# EAGLE design RdL_main_v03 (EAGLE 7.6.0)
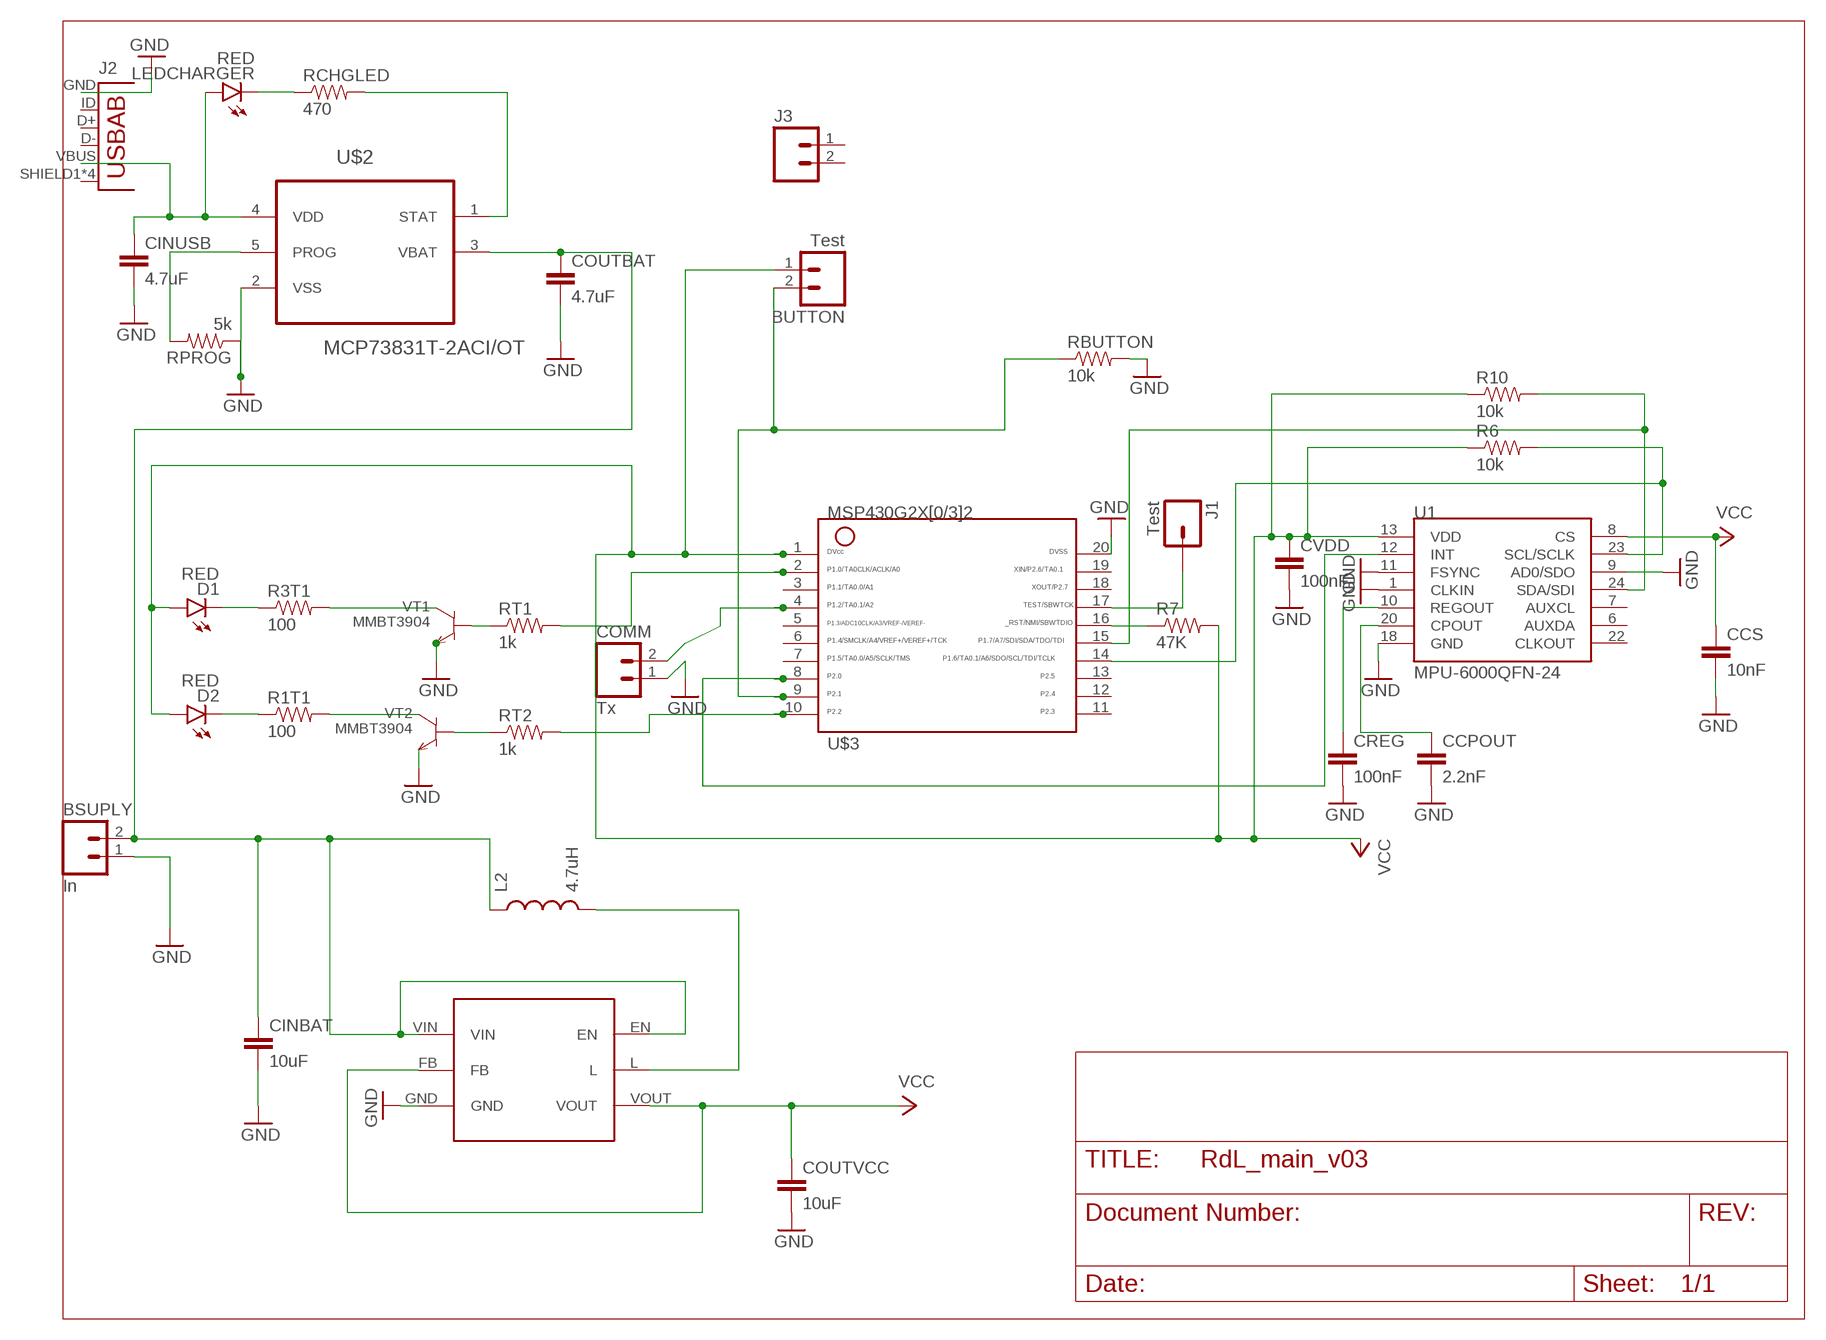
[diagram p0: schematic, sheet 1]

## Parts
BSUPLY  In  M02PTH  [1X02]
BUTTON  Test  M02PTH  [1X02]
CCPOUT  2.2nF  CAP0805  [0805]
CCS  10nF  CAP0805  [0805]
CINBAT  10uF  CAP0805  [0805]
CINUSB  4.7uF  CAP0805  [0805]
COMM  Tx  M02PTH  [1X02]
COUTBAT  4.7uF  CAP0805  [0805]
COUTVCC  10uF  CAP0805  [0805]
CREG  100nF  CAP0805  [0805]
CVDD  100nF  CAP0805  [0805]
D1  RED  LED-RED1206  [LED-1206]
D2  RED  LED-RED1206  [LED-1206]
J1  Test  M01PTH  [1X01]
J2  USB-AB  [USB-AB-MICRO-SMD]
J3  M02-JST-2MM-SMT  [JST-2-SMD]
L2  4.7uH  INDUCTORINDUCTOR_4.7UH  [INDUCTOR_4.7UH]
LEDCHARGER  RED  LED-RED1206  [LED-1206]
R1T1  100  RESISTOR1206  [1206]
R3T1  100  RESISTOR1206  [1206]
R6  10k  RESISTOR0805-RES  [0805]
R7  47K  47KOHM1/10W1%(0603)  [0603-RES]
R10  10k  RESISTOR0805-RES  [0805]
RBUTTON  10k  RESISTOR0805-RES  [0805]
RCHGLED  470  RESISTOR1206  [1206]
RPROG  5k  RESISTOR1206  [1206]
RT1  1k  RESISTOR1206  [1206]
RT2  1k  RESISTOR1206  [1206]
U1  MPU-6000QFN-24  [QFN-24-TESTING]
U$1  TLV61225  [TLV61225DCKT]
U$2  MCP73831T-2ACI/OT  [SOT95P280X145-5N]
U$3  G2X[0/3]2---PW20  [PW20]
VT1  MMBT3904  [SOT23-BEC]
VT2  MMBT3904  [SOT23-BEC]

## Nets
GND: BSUPLY.1 CCPOUT.2 CCS.2 CINBAT.2 CINUSB.2 COMM.1 COUTBAT.2 COUTVCC.2 CREG.2 CVDD.2 J2.GND RBUTTON.2 RPROG.1 U1.1(CLKIN) U1.9(AD0/SDO) U1.11(FSYNC) U1.18(GND) U$1.GND U$2.2(VSS) U$3.20 VT1.E VT2.E
N$1: BUTTON.2 RBUTTON.1 U$3.9
N$2: BSUPLY.2 CINBAT.1 COUTBAT.1 L2.P$1 U$1.EN U$1.VIN U$2.3(VBAT)
N$3: L2.P$2 U$1.L
N$4: J1.1 U$3.17
N$5: CINUSB.1 J2.VBUS LEDCHARGER.A U$2.4(VDD)
N$6: R1T1.2 VT2.C
N$7: R3T1.2 VT1.C
N$8: RT1.1 VT1.B
N$9: RT2.1 VT2.B
N$10: RT1.2 U$3.2
N$11: RT2.2 U$3.10
N$12: R7.1 U$3.16
N$13: D2.C R1T1.1
N$14: D1.C R3T1.1
N$15: COMM.2 U$3.4
N$16: LEDCHARGER.C RCHGLED.1
N$17: RCHGLED.2 U$2.1(STAT)
N$18: U1.12(INT) U$3.8
N$19: RPROG.2 U$2.5(PROG)
N$20: R10.2 U1.24(SDA/SDI) U$3.15
N$22: R6.2 U1.23(SCL/SCLK) U$3.14
N$23: CREG.1 U1.10(REGOUT)
N$26: CCPOUT.1 U1.20(CPOUT)
VCC: BUTTON.1 CCS.1 COUTVCC.1 CVDD.1 D1.A D2.A R6.1 R7.2 R10.1 U1.8(CS) U1.13(VDD) U$1.FB U$1.VOUT U$3.1
Unconnected: J2.D+ J2.D- J2.ID(USBID) J2.SHIELD1(SHIELD) J2.SHIELD2(SHIELD) J2.SHIELD3(SHIELD) J2.SHIELD4(SHIELD) J3.1 J3.2 U1.6(AUXDA) U1.7(AUXCL) U1.22(CLKOUT) U$3.3 U$3.5 U$3.6 U$3.7 U$3.11 U$3.12 U$3.13 U$3.18 U$3.19

## Library data of the parts
BSUPLY BUTTON COMM = SparkFun-Connectors:M02: Standard 2-pin 0.1" header. Use with - straight break away headers ( PRT-00116) - right angle break away headers (PRT-00553) - swiss pins (PRT-00743) - machine pins (PRT-00117) - female headers (PRT-00115) Molex polarized connector foot print use with: PRT-08233 with associated crimp pins and housings. 2.54_SCREWTERM for use with PRT-10571. 3.5mm Screw Terminal footprints for PRT-08084 5mm Screw Terminal footprints for use with PRT-08432
CCPOUT CCS CINBAT CINUSB COUTBAT COUTVCC CREG CVDD = SparkFun-Capacitors:CAP: Capacitor Standard 0603 ceramic capacitor, and 0.1" leaded capacitor.
D1 D2 LEDCHARGER = SparkFun-LED:LED-RED: Assorted Red LEDs LilyPad 1206- DIO-09912 1206- DIO-00809 0603- DIO-00819 "SMART" means more efficient and expensive; PROD_ID: DIO-09912
J1 = SparkFun-Connectors:M01: Header 1 Standard 1-pin 0.1" header. Use with straight break away headers (SKU : PRT-00116), right angle break away headers (PRT-00553), swiss pins (PRT-00743), machine pins (PRT-00117), and female headers (PRT-00115). SMTSO-256-ET is a "flush mount" nut for a 4-40 screw. The older package used to be too tight, and did not allow it to sit properly thru the drill hit. The latest (0.165DIA) fits nice and snug.
J2 = SparkFun-Connectors:USB-AB: This is a USB AB connector that is compatible with USB OTG. i.e. this connector can serve as a host or device
J3 = SparkFun-Connectors:M02: Standard 2-pin 0.1" header. Use with - straight break away headers ( PRT-00116) - right angle break away headers (PRT-00553) - swiss pins (PRT-00743) - machine pins (PRT-00117) - female headers (PRT-00115) Molex polarized connector foot print use with: PRT-08233 with associated crimp pins and housings. 2.54_SCREWTERM for use with PRT-10571. 3.5mm Screw Terminal footprints for PRT-08084 5mm Screw Terminal footprints for use with PRT-08432; PROD_ID: CONN-11443
L2 = SparkFun-Passives:INDUCTOR: Inductors Basic Inductor/Choke - 0603 and 1206. Footprints are not proven and vary greatly between part numbers. INDUCTOR POWER 3.3UH 4.0A SMD 0.197" L x 0.197" W x 0.177" H (5.00mm x 5.00mm x 4.50mm); PROD_ID: NDUC-10146
R1T1 R3T1 R6 R10 RBUTTON RCHGLED RPROG RT1 RT2 = SparkFun-Resistors:RESISTOR: Resistor Basic schematic elements and footprints for 0603, 1206, and PTH resistors.
R7 = SparkFun-Resistors:47KOHM1/10W1%(0603): RES-07871; PROD_ID: RES-07871
U1 = SparkFun-Sensors:MPU-6000: MPU-6000 - I2C address is 0x68 with AD0 low and 0x69 with AD0 high.
U$1 = TLV61225DCKT:TLV61225: TLV61225 Single-Cell High-Efficient Step-up Converter
U$2 = MCP73831T-2ACI_OT:MCP73831T-2ACI/OT: Charge Management Controller; MPN: MCP73831T-2ACI/OT; OC_FARNELL: 1332158; OC_NEWARK: 56K7045; PACKAGE: SOT-5; SUPPLIER: Microchip
U$3 = TI_MSP430_v16:G2X[0/3]2---PW20: MSP430G2X[0/3]2 MSP430G2x32, MSP430G2x02 TSSOP (PW) 20 Pin Package http://focus.ti.com/docs/prod/folders/print/msp430g2432.html
VT1 VT2 = transistor-npn:MMBT3904*: NPN TRANSISTOR

## Net classes
0 default: clearance 0.205 mm

## Board
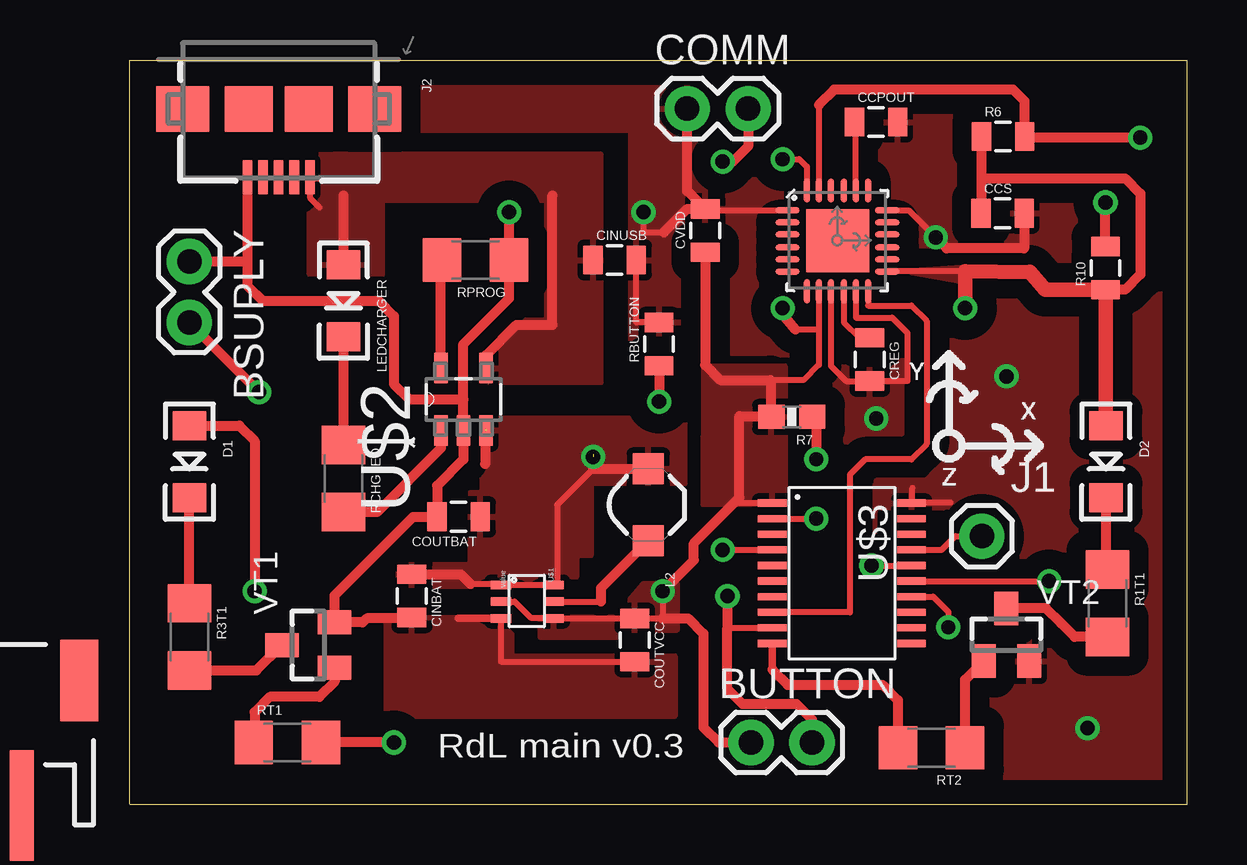
[diagram p1: board, top side]
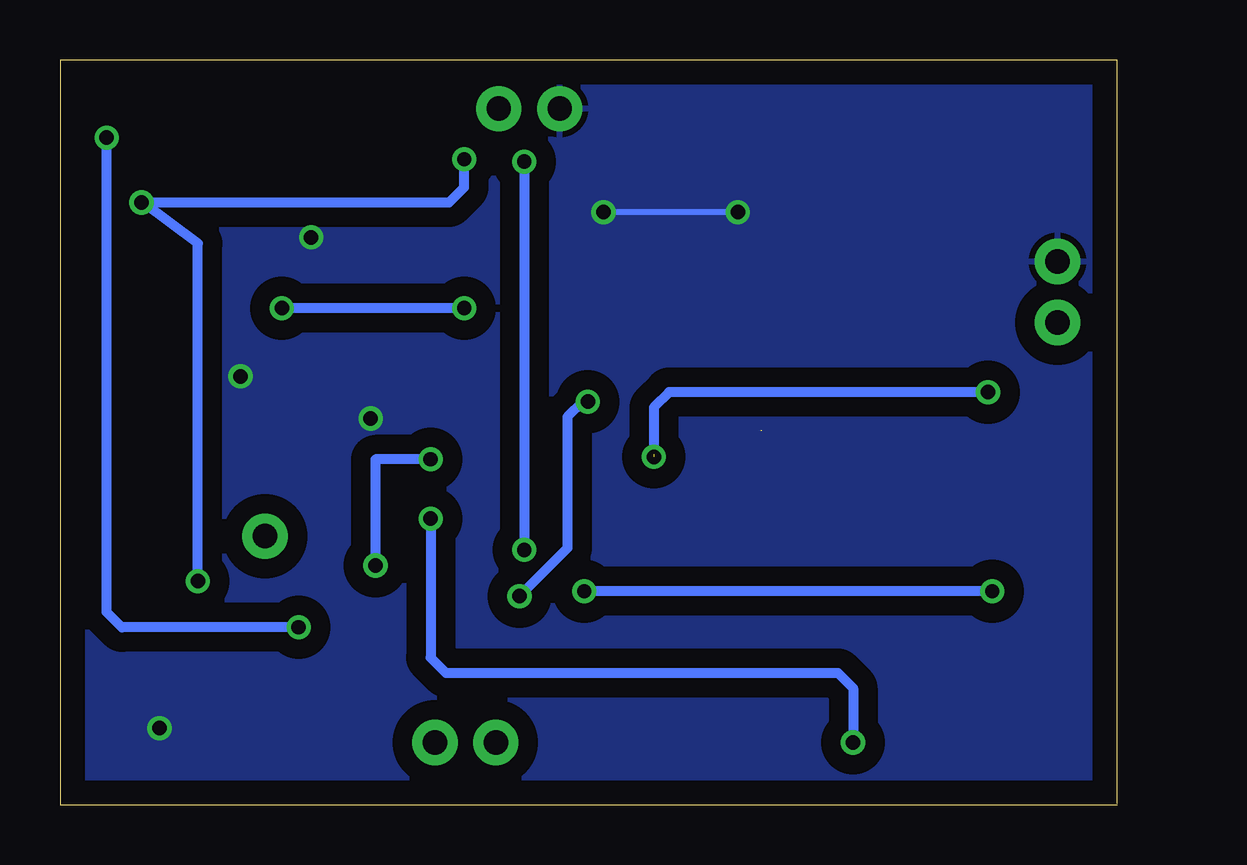
[diagram p2: board, bottom side, seen from below]

Size 44.04 x 31.04 mm. Coordinates in mm from the lower left corner, seen from the top.
Outline: 0,0.05 0,31.04 44.04,31.04 44.04,0 0,0
Copper layers (1*16): Top 0.035mm / dielectric 1.5mm / Bottom 0.035mm
Design rules "default *": minimum track width 10mil, minimum drill 22mil, track to track 8mil, track to pad 8mil, pad to pad 8mil, via to via 8mil, smd to smd 8mil, copper to edge 40mil, drill to drill 8mil, minimum pad ring 10mil, minimum via ring 8mil, stop-mask expansion 4mil, vias tented up to drill 0mil, thermal gap 10mil

### Footprints (pad centres in the part's own frame; a part is rotated, then mirrored left to right if it is on the bottom)
1X02 = drill 1.016 pad 1.88: 1 0,0; 2 2.54,0
0805 = smd 0.8 x 1.2: 1 -0.9,0; 2 0.9,0
LED-1206 = smd 1.2 x 1.4: A -1.5,0; C 1.5,0
1X01 = drill 1.016 pad 1.88: 1 0,0
USB-AB-MICRO-SMD = smd 1.4 x 0.4: D+ 2.85,0; D- 2.85,0.65; GND 2.85,-1.3; ID 2.85,-0.65; VBUS 2.85,1.3 | smd 1.9 x 2.2: SHIELD1 0,4; SHIELD4 0,-4 | smd 1.9 x 2: SHIELD2 0,1.25; SHIELD3 0,-1.25
JST-2-SMD = smd 1 x 4.6: 1 -1,-3.7; 2 1,-3.7 | smd 1.6 x 3.4: NC1 -3.4,1.5; NC2 3.4,1.5
INDUCTOR_4.7UH = smd 1.3 x 1.3: P$1 -1.5,0; P$2 1.5,0
1206 = smd 1.6 x 1.8: 1 -1.4,0; 2 1.4,0
0603-RES = smd 1.1 x 1: 1 -0.85,0; 2 0.85,0
QFN-24-TESTING = smd 1.016 x 0.254: 1 -2.066,1.257; 2 -2.066,0.75; 3 -2.066,0.247; 4 -2.066,-0.287; 5 -2.066,-0.792; 6 -2.066,-1.297; 13 2.086,-1.297; 14 2.086,-0.792; 15 2.086,-0.287; 16 2.086,0.247; 17 2.086,0.75; 18 2.086,1.257 | smd 0.254 x 1.016: 7 -1.267,-2.122; 8 -0.762,-2.122; 9 -0.258,-2.122; 10 0.278,-2.122; 11 0.78,-2.122; 12 1.287,-2.122; 19 1.287,2.082; 20 0.78,2.082; 21 0.278,2.082; 22 -0.258,2.082; 23 -0.762,2.082; 24 -1.267,2.082 | smd 2.616 x 2.616: P$1 0.02,-0.01
TLV61225DCKT = smd 0.35 x 0.85: EN -3,2.2; FB -2.3,0; GND -1.6,0; L -2.3,2.2; VIN -3,0; VOUT -1.6,2.2
SOT95P280X145-5N = smd 1.27 x 0.559: 1 -1.295,0.94; 2 -1.295,0; 3 -1.295,-0.94; 4 1.295,-0.94; 5 1.295,0.94
PW20 = smd 0.3 x 1.2: 1 -2.925,-2.9; 2 -2.275,-2.9; 3 -1.625,-2.9; 4 -0.975,-2.9; 5 -0.325,-2.9; 6 0.325,-2.9; 7 0.975,-2.9; 8 1.625,-2.9; 9 2.275,-2.9; 10 2.925,-2.9; 11 2.925,2.9; 12 2.275,2.9; 13 1.625,2.9; 14 0.975,2.9; 15 0.325,2.9; 16 -0.325,2.9; 17 -0.975,2.9; 18 -1.625,2.9; 19 -2.275,2.9; 20 -2.925,2.9
SOT23-BEC = smd 1 x 1.4: B -0.95,-1.1; C 0,1.1; E 0.95,-1.1

### Placement (x,y rotation side)
BSUPLY  2.48,22.64 270 top
BUTTON  25.88,2.6 0 top
CCPOUT  31.09,28.45 0 top
CCS  36.36,24.65 0 top
CINBAT  11.75,8.71 270 top
CINUSB  20.2,22.7 0 top
COMM  23.22,29.01 0 top
COUTBAT  13.7,12 180 top
COUTVCC  21.04,6.87 270 top
CREG  30.83,18.56 270 top
CVDD  23.97,23.93 90 top
D1  2.48,14.3 270 top
D2  40.67,14.3 270 top
J1  35.5,11.2 0 top
J2  6.2,29 270 top
J3  -5.51,3.68 0 top
L2  21.6,12.5 270 top
LEDCHARGER  8.9,21 270 top
R1T1  40.73,8.4 270 top
R3T1  2.48,7 270 top
R6  36.38,27.85 0 top
R7  27.58,16.17 180 top
R10  40.65,22.37 90 top
RBUTTON  22.05,19.2 90 top
RCHGLED  8.9,13.6 270 top
RPROG  14.4,22.7 180 top
RT1  6.56,2.6 0 top
RT2  33.4,2.38 180 top
U1  29.47,23.52 0 top
U$1  15.46,6.17 270 top
U$2  13.9,16.9 90 top
U$3  29.67,9.65 270 top
VT1  7.43,6.66 90 top
VT2  36.52,7.09 0 top

### Tracks (layer width: path | path; a pad name or v marks a point on that pad's centre or on a via)
GND  (via drill 0.6)
  Top 0.254: 11.75,7.77 CINBAT.2 | U$1.GND 15.46,5.97 COUTVCC.2 | CVDD.2 24.02,24.78 U1.1 | U1.9 29.21,18.3 29.85,17.66 CREG.2 32.4,17.66 32.4,19.67 31.77,20.3 30.25,20.3 U1.11 | v21.4,24.7 21.4,23.85 22.25,23.85 | RBUTTON.2 21.1,20.1 CINUSB.2 | U$3.20 32.6,12.61 32.6,13.2 | 32.6,12.6 34.2,12.6 | U1.18 32.45,24.78 v33.58,23.65
  Top 0.305: 15.32,7.77 13.69,7.77
  Top 0.406: 13.9,16.9 U$2.2 13.9,14.4 12.8,13.3 COUTBAT.2 11.8,12 8.53,8.73 VT1.E 9.7,7.6 9.87,7.77 11.75,7.77 | 13.9,16.9 13.9,19.2 15.8,21.1 RPROG.1 v15.8,24.7 | J2.GND 4.9,22.64 | 4.9,22.64 BSUPLY.1 | 4.9,22.64 4.9,21.64 5.54,21 10.37,21 11,20.37 11,17.54 11.63,16.9 13.9,16.9 | 22.25,23.85 23.23,24.83 CVDD.2 23.22,25.58 COMM.1 | CCS.2 37.26,23.19 34.04,23.19 v33.58,23.65
  Bottom 0.254: v15.8,24.7 v21.4,24.7
  other vias: 39.9,3.2 31.1,16.1 36.53,17.86
  pour Top (isolate 0.813): 10.7,7.8 15.9,7.8 15.9,6.2 22.7,6.2 22.7,3.7 10.7,3.7
  pour Top (isolate 0.813): 0.1,31 44.9,31 44.9,0.3 23.9,0.3 23.9,17.8 20.9,17.8 20.9,28.1 0,28.1 0,30.6
  pour Bottom (isolate 0.813): 0.1,30.9 0.1,0.1 44.9,0.1 44.9,30.9
  pour Top: 31.1,13.4 31.1,12.4 33.9,12.4 33.9,13.5 33.7,13.5 31.1,13.5
N$1  (via drill 0.6)
  Top 0.254: 24.9,7.38 U$3.9
  Top 0.406: RBUTTON.1 v22.05,16.8 | v24.9,8.7 24.9,7.38 24.9,4.84 25.54,4.2 27.79,4.2 28.42,3.57 BUTTON.2
  Bottom 0.254: v22.05,16.8 22.27,16.8
  Bottom 0.406: 22.27,16.8 22.9,16.17 22.9,10.7 v24.9,8.7
N$2  (via drill 0.6)  (2 unrouted)
  Top 0.254: 19.3,14 17.8,12.5 17.8,9.31 U$1.EN U$1.VIN | 15.5,9.2 14.2,9.2
  Top 0.406: 14.8,15.6 14.8,14.2 | 19.3,14 L2.P$1 | CINBAT.1 13.79,9.61 14.2,9.2 | BSUPLY.2 v5.38,17.2
  Bottom 0.406: v5.38,17.2 18.66,17.2 19.3,16.57 19.3,14.6
  other vias: 19.3,14.5
  pour Top (isolate 0.813): 11.2,9.1 11.2,10 14.2,10 14.2,13 14.7,13 14.7,16.1 23.1,16.1 23.1,13.4 19.2,13.4 19.2,10.4 18.6,10.4 18.6,9.1
N$3
  Top 0.254: U$1.L 19.64,8.47
  Top 0.406: 19.64,8.47 19.64,9.04 L2.P$2
N$4
  Top 0.254: U$3.17 33.83,10.63 34.4,11.2 J1.1
N$5
  Top 0.254: J2.VBUS 7.5,26.1 | 7.5,26.1 7.5,25.3 7.9,24.9 | 7.5,26.1 8.1,26.1
  Top 0.406: U$2.4 14.84,18.74 16.1,20 17.6,20 17.6,25.4 | 8.9,25.4 LEDCHARGER.A
  pour Top (isolate 0.813): 14.6,17.6 14.6,18.9 15.9,20.2 17.4,20.2 17.4,25.2 10.5,25.2 10.5,22.1 7.5,22.1 7.5,27.1 19.6,27.1 19.6,17.6
N$6
  Top 0.254: VT2.C
  Top 0.406: R1T1.2 39.37,7 38.8,7.57 38.16,8.2 VT2.C
N$7
  Top 0.406: R3T1.2 5.27,5.6 VT1.C
N$8
  Top 0.406: VT1.B 8.53,5.14 7.89,4.5 5.83,4.5 5.2,3.87 5.2,2.6 RT1.1
N$9
  Top 0.406: RT2.1 34.8,5.22 VT2.B
N$10  (via drill 0.6)
  Top 0.254: U$3.2 v28.6,11.93
  Top 0.406: v11,2.6 RT1.2
  Bottom 0.406: v28.6,11.93 28.6,6.14 27.96,5.5 11.63,5.5 11,4.87 v11,2.6
N$11
  Top 0.305: U$3.10 26.77,5.64
  Top 0.406: 26.77,5.64 27.41,5 31.36,5 32,4.37 RT2.2
N$12  (via drill 0.6)
  Top 0.254: R7.1 28.6,16 | v30.9,9.97 U$3.16
  Top 0.406: 28.6,16 v28.6,14.4
  Bottom 0.406: v28.6,14.4 30.9,14.4 v30.9,9.97
N$13
  Top 0.254: 40.67,9.8 R1T1.1
  Top 0.406: D2.C 40.67,9.8
N$14
  Top 0.406: R3T1.1 D1.C
N$15  (via drill 0.6)
  Top 0.254: v24.7,10.63 U$3.4
  Top 0.406: COMM.2 25.76,27.44 25.12,26.8 v24.7,26.8
  Bottom 0.406: v24.7,26.8 v24.7,10.63
N$16
  Top 0.406: LEDCHARGER.C RCHGLED.1
N$17
  Top 0.406: U$2.1 12.96,14.86 10.3,12.2 RCHGLED.2
N$18
  Top 0.254: U1.12 30.76,20.8 32.56,20.8 33.2,20.17 33.2,15.04 32.56,14.4 30.64,14.4 30,13.77 30,8.03 U$3.8
N$19
  Top 0.406: U$2.5 12.96,22.66 RPROG.2
N$20  (via drill 0.6)
  Top 0.254: v27.2,26.9 27.88,26.91 28.2,26.59 U1.24 | U$3.15 v38.3,9.33 | 40.5,25.1 v40.65,25.1
  Top 0.406: R10.2 v40.65,25.1
  Bottom 0.254: v40.65,25.1 40.6,25.1
  Bottom 0.406: v27.2,26.9 27.2,25.74 27.84,25.1 40.6,25.1 38.3,23.4 v38.3,9.33
N$22  (via drill 0.6)
  Top 0.254: 28.71,29.17 U1.23 | U$3.14 33.47,8.68 34.1,8.04 v34.1,7.4 | 37.28,27.8 R6.2
  Top 0.406: R6.2 37.28,29.32 36.8,29.8 29.34,29.8 28.71,29.17 | v42.1,27.8 37.28,27.8
  Bottom 0.406: v34.1,7.4 41.47,7.4 42.1,8.04 v42.1,27.8
N$23
  Top 0.254: U1.10 29.75,20.1 30.38,19.46 CREG.1
N$26
  Top 0.254: U1.20 30.25,28.39 CCPOUT.1
VCC  (via drill 0.6)
  Top 0.254: U$1.FB 16.03,8.47 16.7,7.8 17.63,7.8 U$1.VOUT COUTVCC.1 22.2,7.77 v22.2,8.9 | 35.48,24.67 CCS.1 35.48,26.1 | 37.5,22.21 37.5,22.2 | 34.8,22.23 U1.13 | R10.1 40.67,21.47 | U$3.1 25.4,12.58 25.4,12.8 | 26.73,16.2 R7.2 26.7,16.17 | 28.71,19.8 28.71,18.34 28.07,17.7 26.7,17.7 | U1.8 28.71,19.8 | 28.71,19.8 27.73,19.8
  Top 0.406: R6.1 35.48,26.1 | 35.48,26.1 35.48,24.67 | 35.48,26.1 41.47,26.1 42.1,25.47 42.1,22.11 41.47,21.47 R10.1 | 22.2,7.77 23.27,7.77 23.9,7.14 23.9,3.24 24.54,2.6 BUTTON.1 | 26.73,16.2 25.4,16.2 25.4,12.8 23.5,10.9 23.5,10.2 v22.2,8.9 | 26.7,16.17 26.7,17.7 24.61,17.7 23.97,18.34 CVDD.1 | D1.A 4.57,15.8 5.2,15.17 v5.2,8.9 | 27.73,19.8 27.2,20.44 v27.2,20.7
  Top 0.61: R10.1 38.13,21.47 37.5,22.21 | 37.5,22.2 34.8,22.23 v34.8,20.7 | 40.67,21.47 D2.A
  Bottom 0.406: v5.2,8.9 v22.2,8.9 | v27.2,20.7 v34.8,20.7
  pour Top (isolate 0.406): 17.1,7.8 17.1,7 20.3,7 20.3,7.3 22.8,7.3 22.8,9.2 21.4,9.2 20.2,7.8
  pour Top (isolate 0.305): 23.93,18.29 27.28,18.29 27.28,12.52 23.93,12.52 23.9,12.52
  pour Top: 32.59,22.23 34.95,22.38 34.95,21.79

### Text on the board
tPlace: RdL main v0.3